# EasyEDA Pro project pcb easy eda pro stm32wb5mmg01 - Elektor.eprj, schematic Shield MB STM32WB55
Create Date: 2023-10-26; Page Name: P1; Project Name: stm32wb5mmg01; Schematic Name: Shield MB STM32WB55; Update Date: 2023-11-05; Company: ROMASZEWSKI; Drawed: ROMASZEWSKI; Page Size: A4; Part Number: JLCPCB-002; Reviewed: EasyEDA Pro; Version: V0.1
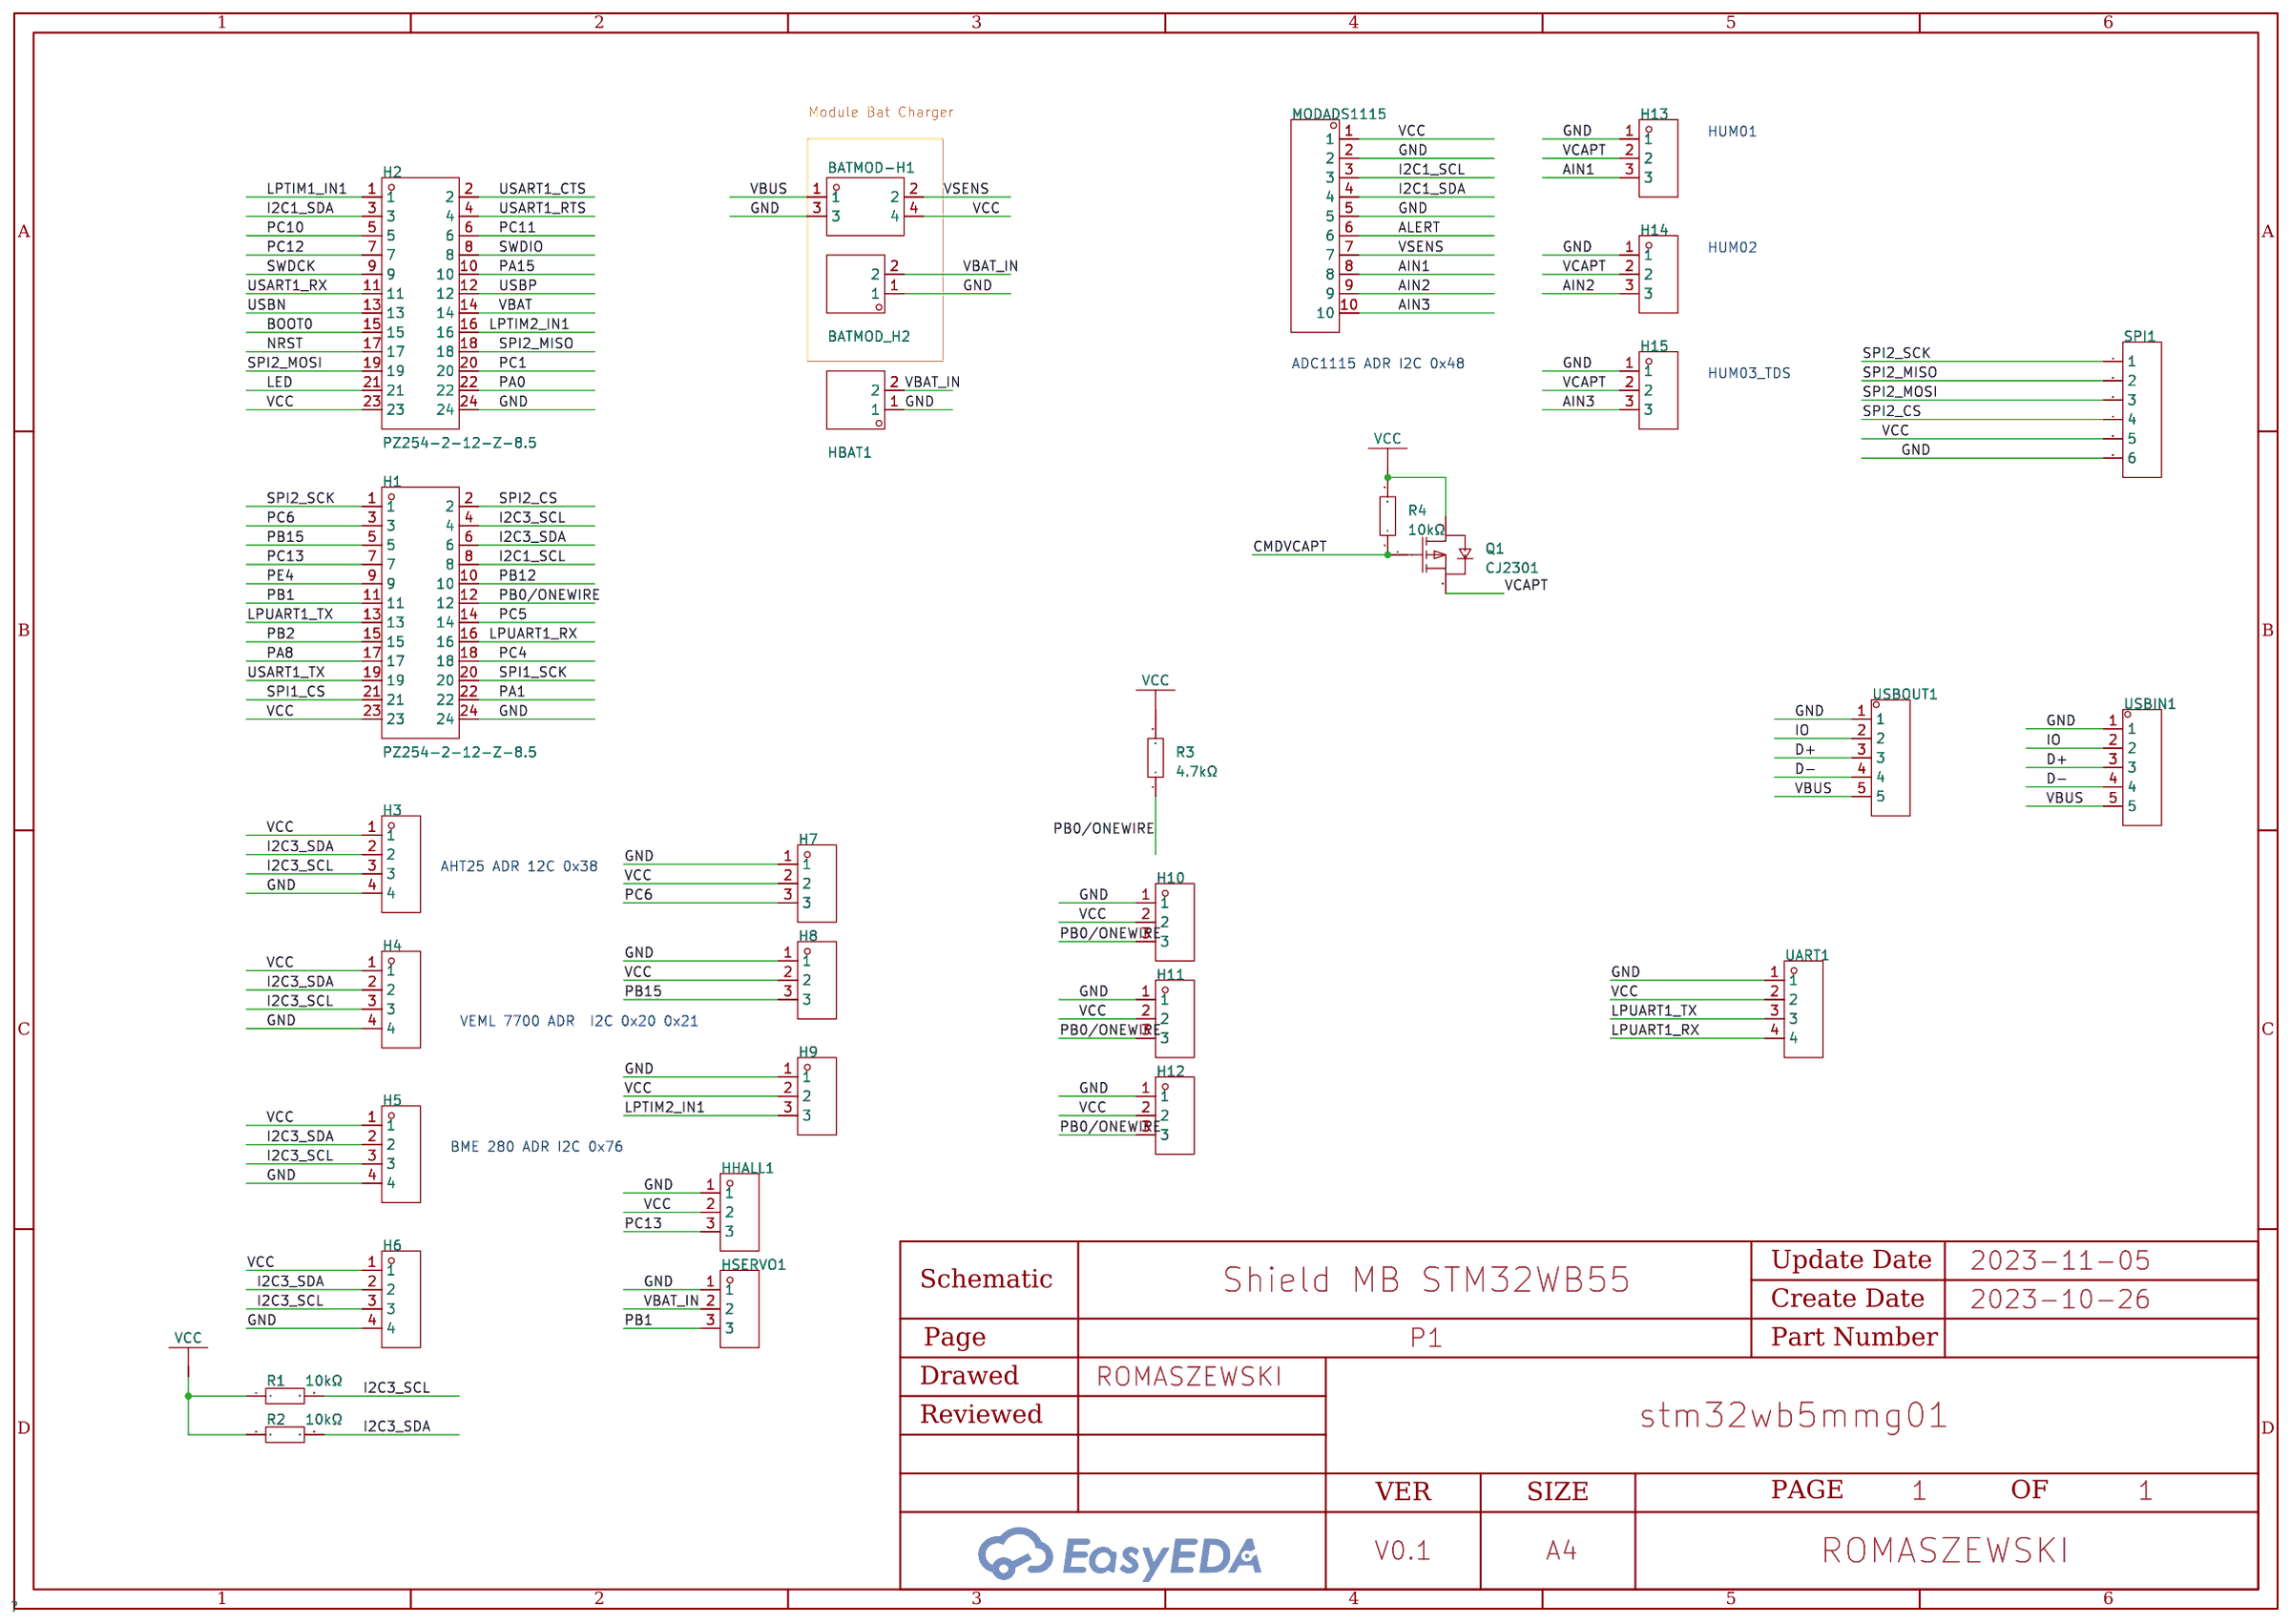
[diagram p0: schematic sheet]

## Parts
BATMOD-H1  -  [HDR-TH_4P-P2.54-V-M-R2-C2-S2.54-1]  (no BOM)
BATMOD_H2  -  [HDR-TH_2P-P2.54-V-M-1]  (no BOM)
H1  PZ254-2-12-Z-8.5  [HDR-TH_24P-P2.54-V-M-R2-C12-S2.54]
H2  PZ254-2-12-Z-8.5  [HDR-TH_24P-P2.54-V-M-R2-C12-S2.54]
H3  -  [HDR-TH_4P-P2.54-V-M]
H4  -  [HDR-TH_4P-P2.54-V-M]
H5  -  [HDR-TH_4P-P2.54-V-M]
H6  -  [HDR-TH_4P-P2.54-V-M]
H7  -  [HDR-TH_3P-P2.54-V-M]
H8  -  [HDR-TH_3P-P2.54-V-M]
H9  -  [HDR-TH_3P-P2.54-V-M]
H10  -  [HDR-TH_3P-P2.54-V-M]
H11  -  [HDR-TH_3P-P2.54-V-M]
H12  -  [HDR-TH_3P-P2.54-V-M]
H13  -  [HDR-TH_3P-P2.54-V-M]
H14  -  [HDR-TH_3P-P2.54-V-M]
H15  -  [HDR-TH_3P-P2.54-V-M]
HBAT1  -  [HDR-TH_2P-P2.54-V-M-1]  (no BOM)
HHALL1  -  [HDR-TH_3P-P2.54-V-M]
HSERVO1  -  [HDR-TH_3P-P2.54-V-M]
MODADS1115  -  [HDR-TH_10P-P2.54-V-M-1]
Q1  CJ2301  [SOT-23-3_L2.9-W1.3-P1.90-LS2.4-BR]
R1  10kΩ  [R1206]
R2  10kΩ  [R1206]
R3  4.7kΩ  [R1206]
R4  10kΩ  [R1206]
SPI1  -  [HDR-TH_6P-P2.54-V-M-1]
UART1  -  [HDR-TH_4P-P2.54-V-M]
USBIN1  -  [HDR-TH_5P-P2.54-V-M]
USBOUT1  -  [HDR-TH_5P-P2.54-V-M]

## Library data of the parts
BATMOD-H1 = HDR-M_2.54_2x2: Supplier Footprint: Through
BATMOD_H2 HBAT1 = HDR-M_2.54_1x2P: Supplier Footprint: Through
H1 H2 = PZ254-2-12-Z-8.5: Number of Rows:双排 Number of Pins:24P Pitch:2.54mm Pin Structure:2x12P Row Spacing:2.54mm Mounting Type:Straight Circluar Pins/Square Pins:Square Pins Current Rating (Max):3A Voltage Rating (Max):- Length of Mating Pin:6mm Insulation Height:2.5mm Length of; LCSC Part Name: 2.54mm 2x12P 直插 方针; Supplier Part: C2894973; Manufacturer: HCTL(华灿天禄); Supplier Footprint: 插件,P=2.54mm; JLCPCB Part Class: Extended Part; Datasheet: https://atta.szlcsc.com/upload/public/pdf/source/20230609/5BA09C8BEB9B31376F8BF6032FF67CAC.pdf; Supplier: LCSC; Number of Rows: 双排; Number of Pins: 24P; Pitch: 2.54mm; Pin Structure: 2x12P; Row Spacing: 2.54mm; Mounting Type: Straight; Circluar Pins/Square Pins: Square Pins; Current Rating (Max): 3A; Length of Mating Pin: 6mm; Insulation Height: 2.5mm; Length of End Connection Pin: 3mm; Operating Temperature Range: -40℃~+105℃; Color: Black
H3-H6 UART1 = HDR-M_2.54_1x4P: Supplier Footprint: Through
H7-H15 HHALL1 HSERVO1 = HDR-M_2.54_1x3P: Supplier Footprint: Through
MODADS1115 = HDR-M_2.54_1x10P: Supplier Footprint: Through
Q1 = CJ2301: Type: Drain Source Voltage (Vdss): Continuous Drain Current (Id): Power Dissipation (Pd):0.4W Drain Source On Resistance (RDS(on)@Vgs,Id):0.09Ω@4.5V,2.8A Gate Threshold Voltage (Vgs(th)@Id):0.7V@250uA Total Gate Charge (Qg@Vgs):3.3nC@4.5V Input Capacitanc; LCSC Part Name: P沟道 20V 2.3A; Supplier Part: C2910170; Manufacturer: CJ(江苏长电/长晶); Supplier Footprint: SOT-23; JLCPCB Part Class: Extended Part; Datasheet: https://atta.szlcsc.com/upload/public/pdf/source/20211124/BEFC8264A25F50CCE75F0C89F43493A4.pdf; Supplier: LCSC; Power Dissipation (Pd): 0.4W; Drain Source On Resistance (RDS(on)@Vgs,Id): 0.09Ω@4.5V,2.8A; Gate Threshold Voltage (Vgs(th)@Id): 0.7V@250uA; Total Gate Charge (Qg@Vgs): 3.3nC@4.5V; Input Capacitance (Ciss@Vds): 405pF@10V; Reverse Transfer Capacitance (Crss@Vds): 55pF@10V; Operating Temperature: -55℃~+150℃@(Tj)
R1-R4 = Res_1206: Supplier Footprint: 1206
SPI1 = HDR-M_2.54_1x6P: Supplier Footprint: Through
USBIN1 USBOUT1 = HDR-M_2.54_1x5P: Supplier Footprint: Through

## Nets
GND: BATMOD-H1.3 BATMOD_H2.1 H1.24 H2.24 H3.4 H4.4 H5.4 H6.4 H7.1 H8.1 H9.1 H10.1 H11.1 H12.1 H13.1 H14.1 H15.1 HBAT1.1 HHALL1.1 HSERVO1.1 MODADS1115.2 MODADS1115.5 SPI1.6 UART1.1 USBIN1.1 USBOUT1.1
VBAT: H2.14
VBAT_IN: BATMOD_H2.2 HBAT1.2 HSERVO1.2
VBUS: BATMOD-H1.1 USBIN1.5 USBOUT1.5
VCC: BATMOD-H1.4 H1.23 H2.23 H3.1 H4.1 H5.1 H6.1 H7.2 H8.2 H9.2 H10.2 H11.2 H12.2 HHALL1.2 MODADS1115.1 Q1.3(D) R1.1 R2.1 R3.2 R4.2 SPI1.5 UART1.2
AIN1: H13.3 MODADS1115.8
AIN2: H14.3 MODADS1115.9
AIN3: H15.3 MODADS1115.10
ALERT: MODADS1115.6
BOOT0: H2.15
CMDVCAPT: Q1.1(G) R4.1
D+: USBIN1.3 USBOUT1.3
D-: USBIN1.4 USBOUT1.4
I2C1_SCL: H1.8 MODADS1115.3
I2C1_SDA: H2.3 MODADS1115.4
I2C3_SCL: H1.4 H3.3 H4.3 H5.3 H6.3 R1.2
I2C3_SDA: H1.6 H3.2 H4.2 H5.2 H6.2 R2.2
IO: USBIN1.2 USBOUT1.2
LED: H2.21
LPTIM1_IN1: H2.1
LPTIM2_IN1: H2.16 H9.3
LPUART1_RX: H1.16 UART1.4
LPUART1_TX: H1.13 UART1.3
NRST: H2.17
PA0: H2.22
PA1: H1.22
PA8: H1.17
PA15: H2.10
PB0/ONEWIRE: H1.12 H10.3 H11.3 H12.3 R3.1
PB1: H1.11 HSERVO1.3
PB2: H1.15
PB12: H1.10
PB15: H1.5 H8.3
PC1: H2.20
PC4: H1.18
PC5: H1.14
PC6: H1.3 H7.3
PC10: H2.5
PC11: H2.6
PC12: H2.7
PC13: H1.7 HHALL1.3
PE4: H1.9
SPI1_CS: H1.21
SPI1_SCK: H1.20
SPI2_CS: H1.2 SPI1.4
SPI2_MISO: H2.18 SPI1.2
SPI2_MOSI: H2.19 SPI1.3
SPI2_SCK: H1.1 SPI1.1
SWDCK: H2.9
SWDIO: H2.8
USART1_CTS: H2.2
USART1_RTS: H2.4
USART1_RX: H2.11
USART1_TX: H1.19
USBN: H2.13
USBP: H2.12
VCAPT: H13.2 H14.2 H15.2 Q1.2(S)
VSENS: BATMOD-H1.2 MODADS1115.7

## Notes on the sheet
- Module Bat Charger
- HUM01
- HUM02
- ADC1115 ADR I2C 0x48
- HUM03_TDS
- AHT25 ADR 12C 0x38
- VEML 7700 ADR  I2C 0x20 0x21
- BME 280 ADR I2C 0x76
